# Altium schematic sheet digital_ruler _new.SchDoc: Digital Ruler
size A4; DrawnBy: Malith Jayalath; Revision: 3; SheetNumber: 1; SheetTotal: 1
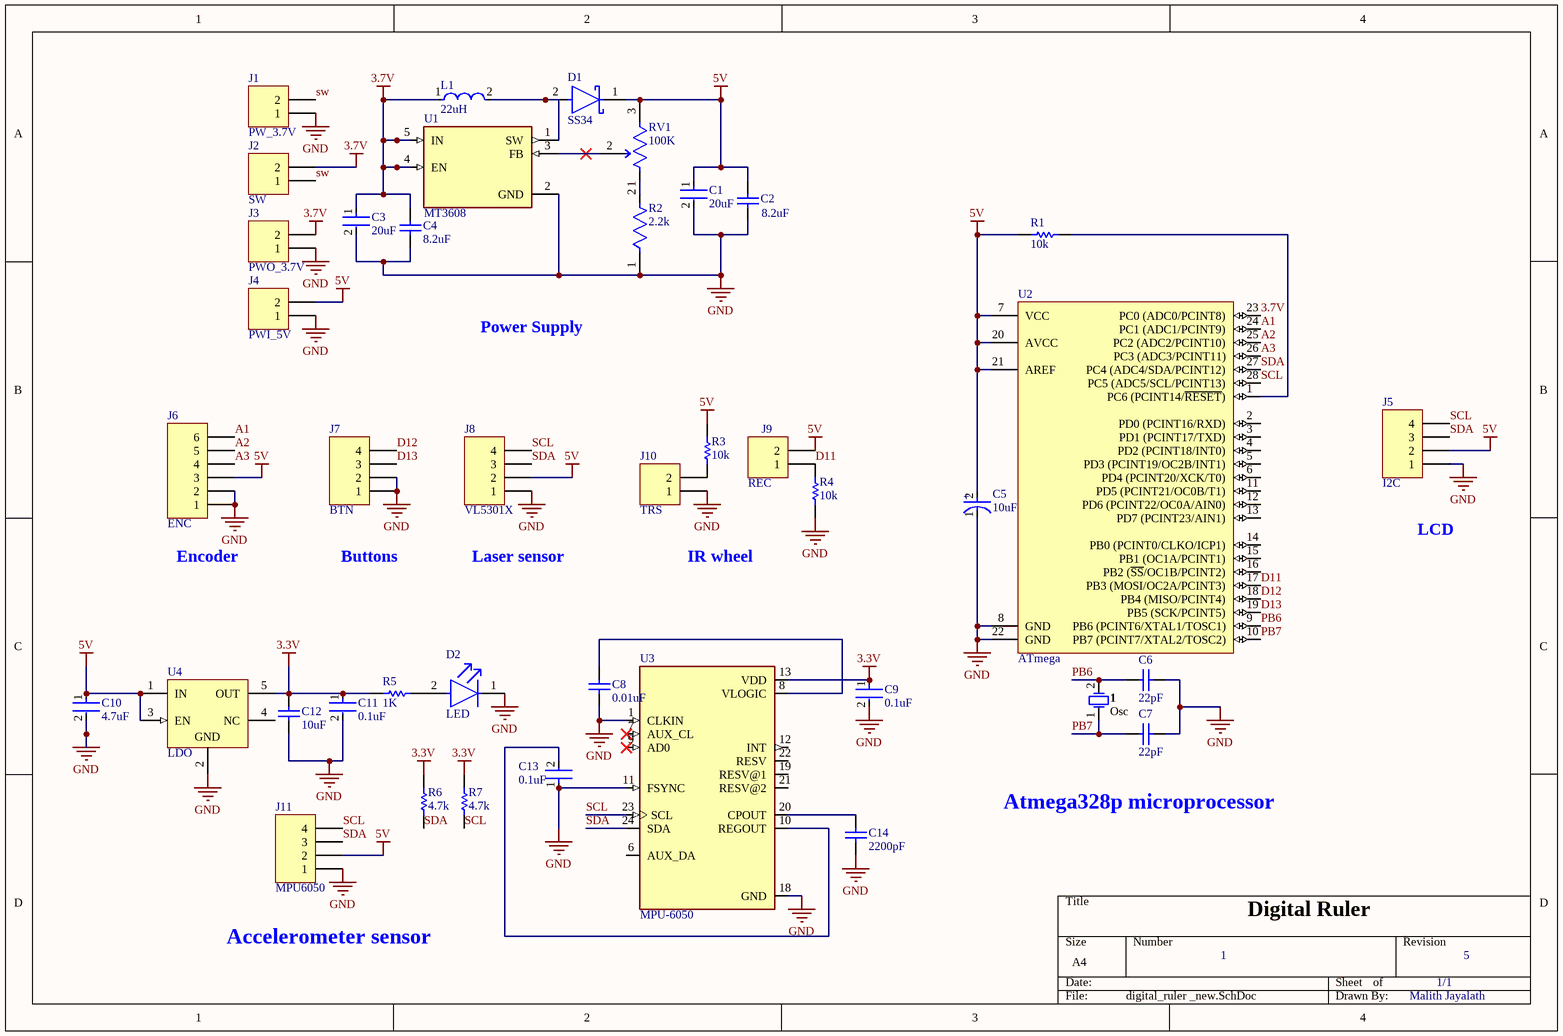
[diagram p0: digital_ruler _new.SchDoc]

## Parts
1  Osc  [FOX-FOXSLF160-20]
C1  20uF  [FP-GRMJN7-0_1-IPC_C]
C2  8.2uF  [CAPC1206(3216)190_N]
C3  20uF  [FP-GRMJN7-0_1-IPC_C]
C4  8.2uF  [CAPC1206(3216)190_N]
C5  10uF  [FP-FKC-MFG]
C6  22pF  [CAPC1608X90X35ML10T15]
C7  22pF  [CAPC1608X90X35ML10T15]
C8  0.01uF  [CAPC1608X90X35ML10T15]
C9  0.1uF  [FP-CGA6P-IPC_A]
C10  4.7uF  [FP-CL10-IPC_A]
C11  0.1uF  [FP-CGA6P-IPC_A]
C12  10uF  [CAPC2013X95X50LL10T25]
C13  0.1uF  [FP-CGA6P-IPC_A]
C14  2200pF  [CAPC1608X90X35NL10T15]
D1  SS34  [FP-95402-MFG]
D2  LED  [FP-LTST-C193TBKT-5A-MFG]
J1  PW_3.7V  [HDR1X2]
J2  SW  [HDR1X2]
J3  PWO_3.7V  [HDR1X2]
J4  PWI_5V  [HDR1X2]
J5  I2C  [HDR1X4]
J6  ENC  [HDR1X6]
J7  BTN  [HDR1X4]
J8  VL5301X  [HDR1X4]
J9  REC  [HDR1X2]
J10  TRS  [HDR1X2]
J11  MPU6050  [HDR1X4]
L1  22uH  [FP-IHLP-2525CZ-FP_2_413x3-MFG]
R1  10k  [RESC1005X40X25ML05T05]
R2  2.2k  [FP-ERA2A-MFG]
R3  10k  [RESC1005X40X25ML05T05]
R4  10k  [RESC1005X40X25ML05T05]
R5  1K  [RESC2013X60X35ML10T20]
R6  4.7k  [RESC2013X70X40NL20T20]
R7  4.7k  [RESC2013X70X40NL20T20]
RV1  100K  [FP-3386P-MFG]
U1  MT3608  [SOT95P280X145-6N]
U2  ATmega  [28P3]
U3  MPU-6050  [QFN50P400X400X95-24N]
U4  LDO  [DBV0005A_M]

## Nets
3.3V: C9.1 C11.1 C12.2 R5.1 R6.1 R7.1 U3.13(VDD) U4.5(OUT)
3.7V: C3.1 C4.2 J2.2 J3.2 L1.1 U1.4(EN) U1.5(IN) U2.23(PC0_(ADC0/PCINT8))
5V: C1.1 C2.2 C5.2(A) C10.1 D1.1(C) J4.2 J5.2 J6.3 J8.2 J9.2 J11.2 R1.1 R3.1 RV1.3(CW) U2.7(VCC) U2.20(AVCC) U2.21(AREF) U4.1(IN) U4.3(EN)
GND: C1.2 C2.1 C3.2 C4.1 C5.1(C) C6.1 C7.1 C8.1 C9.2 C10.2 C11.2 C12.1 C13.1 C14.1 D2.1(C) J1.1 J3.1 J4.1 J5.1 J6.1 J6.2 J7.1 J7.2 J8.1 J10.1 J11.1 R2.1 R4.1 U1.2(GND) U2.8(GND) U2.22(GND) U3.1(CLKIN) U3.11(FSYNC) U3.18(GND) U4.2(GND)
A1: J6.6 U2.24(PC1_(ADC1/PCINT9))
A2: J6.5 U2.25(PC2_(ADC2/PCINT10))
A3: J6.4 U2.26(PC3_(ADC3/PCINT11))
D11: J9.1 R4.2 U2.17(PB3_(MOSI/OC2A/PCINT3))
D12: J7.4 U2.18(PB4_(MISO/PCINT4))
D13: J7.3 U2.19(PB5_(SCK/PCINT5))
PB6: 1.2 C6.2 U2.9(PB6_(PCINT6/XTAL1/TOSC1))
PB7: 1.1 C7.2 U2.10(PB7_(PCINT7/XTAL2/TOSC2))
SCL: J5.4 J8.4 J11.4 R7.2 U2.28(PC5_(ADC5/SCL/PCINT13)) U3.23(SCL)
SDA: J5.3 J8.3 J11.3 R6.2 U2.27(PC4_(ADC4/SDA/PCINT12)) U3.24(SDA)
sw: J1.2 J2.1
NetC8_2: C8.2 U3.8(VLOGIC)
NetC13_2: C13.2 U3.10(REGOUT)
NetC14_2: C14.2 U3.20(CPOUT)
NetD1_2: D1.2(A) L1.2 U1.1(SW)
NetD2_2: D2.2(A) R5.2
NetJ10_2: J10.2 R3.2
NetR1_2: R1.2 U2.1(PC6_(PCINT14/~{RESET}))
NetR2_2: R2.2 RV1.1(CCW)
NetRV1_2: RV1.2(WIPER) U1.3(FB)

Not connected (* = marked no-connect by the designer): U2 2(PD0_(PCINT16/RXD)) 3(PD1_(PCINT17/TXD)) 4(PD2_(PCINT18/INT0)) 5(PD3_(PCINT19/OC2B/INT1)) 6(PD4_(PCINT20/XCK/T0)) 11(PD5_(PCINT21/OC0B/T1)) 12(PD6_(PCINT22/OC0A/AIN0)) 13(PD7_(PCINT23/AIN1)) 14(PB0_(PCINT0/CLKO/ICP1)) 15(PB1_(OC1A/PCINT1)) 16(PB2_(~{SS}/OC1B/PCINT2)); U3 6(AUX_DA) 7(AUX_CL)* 9(AD0)* 12(INT) 19(RESV@1) 21(RESV@2) 22(RESV); U4 4(NC)

## Notes on the sheet
- Power Supply
- LCD
- (near J6) Encoder
- Buttons
- Laser sensor
- IR wheel
- Atmega328p microprocessor
- Accelerometer sensor
- Digital Ruler
- 1
- 1/1
- 5
- Malith Jayalath
- (in symbol CMP-05427-000030-1) +

## Library data of the parts
1 = CMP-1749-00003-1: Resistance Weld Thru-Hole Crystal, 16 MHz, -20 to 70 degC, 2-Pin THD, RoHS, Bulk; Voltage Rating: 250 V; Tolerance: 1%; Resistance: 221 kohm; Case\Package: Axial; Power Rating: 250 mW; RoHSCompliant: true; Package Quantity: 200; Packaging: Bulk; Min Operating Temperature: -55 degC; DatasheetVersion: Mar-15; ComponentLink1URL: http://www.foxonline.com/; Max Operating Temperature: 155 degC; PackageReference: FOXSLF160-20; Mount: Through Hole; PackageDescription: 2-Pin Through Hole Device, Body 11.35 x 4.65 mm; ComponentLink1Description: Manufacturer URL; ComponentLink2URL: http://www.foxonline.com/pdfs/hc49slf.pdf; ComponentLink2Description: Datasheet; Length: 0.248 inch
C1 C3 = CMP-06035-061017-1: Chip Multilayer Ceramic Capacitors for General Purpose, 0704, 20uF, X5R, 15%, 20%, 16V
C2 C4 = CMP-1037-04959-1: CAP 8.2uF 16V ±20% 1206 (3216 Metric) Thickness 1.9mm SMD; Case-EIA: 1206; Case-Metric: 3216; Tolerance: Â±20%; Technology: SMT; Max Thickness: 1.9 mm; Value: 8.2uF; Rated Voltage: 16 V
C5 = CMP-05427-000030-1: CAP ALUM 10UF 20% 50V SMD; Impedance: 1.52R; Ripple Current (AC): 85mA; Life (Hours): 2000Hour; Leakage Current: 3uA; Dielectric Material: Aluminium; Length: 5.8mm; Voltage Rating: 50V; Radiation Hardening: No; Max Operating Temperature: 105°C; REACH SVHC: No SVHC; Tolerance: 20%; RoHS Compliant: Yes; Case/Package: Radial; Height: 5.8mm; Voltage: 50V; Diameter: 5mm; Number of Pins: 2; Ripple Current: 85mA; Series: FK; Lead Free: Lead Free; Width: 6.5mm; ESR (Equivalent Series Resistance): 1.52R; Package Quantity: 1000; Construction: Cylindrical; Voltage Rating (DC): 50V; Packaging: Tape and Reel; Height - Seated (Max): 0.228inch; Contact Plating: Tin; Capacitance: 10uF; Min Operating Temperature: -55°C; Termination: SMD/SMT; Material: Aluminium; Mount: Surface Mount
C6 C7 = CMP-2000-04945-1: Chip Capacitor, 22 pF, +/- 5%, 50 V, -55 to 125 degC, 0603 (1608 Metric), RoHS, Tape and Reel; Manufacturer: Murata; Rated Voltage: 50V; Dielectric: C0G; Capacitance: 22pF; Manufacturer URL: http://www.murata.com/; Datasheet Version: Jul-06; Package Reference: 603; Tolerance (%): ±5%; Case Size/Dimension: 0603; Package Description: 2-Pin Surface Mount Device, Body 1.6 x 0.8 mm; Datasheet URL: https://datasheet.ciiva.com/11786/0900766b807a1cab-11786398.pdf
C8 = CMP-2100-03642-1: Chip Capacitor, 10 nF, +/- 10%, 50 V, -55 to 125 degC, 0603 (1608 Metric), RoHS, Tape and Reel; Manufacturer: Murata; Insulation Resistance: 10GR; Dielectric: X7R; Voltage Rating: 50V; Capacitance: 10nF; Material: Ceramic; Package Quantity: 1; Lead Free: LeadFree; Case/Package: 0603; Termination: SMD/SMT; REACH SVHC: Unknown; Manufacturer URL: http://www.murata.com/; Datasheet URL: http://search.murata.co.jp/Ceramy/image/img/A01X/G101/ENG/GRM188R71H103KA01-01.pdf; Mount: SurfaceMount; Datasheet Version: 42401.0; Number of Pins: 2; Length: 1.6mm; Voltage: 50V; Depth: 0.8mm; Tolerance: 10%; Min Operating Temperature: -55degC; Voltage Rating (DC): 50V; Max Operating Temperature: 125degC; Package Description: 2-Pin Surface Mount Device, Body 1.6 x 0.8 mm; RoHSCompliant: True; Case Code (Imperial): 0603; Width: 0.031inch; Case Code (Metric): 1608; Height: 0.8mm; Package Reference: 0603; Packaging: TapeandReel; Thickness: 0.035inch; Dielectric Material: Ceramic
C9 C11 C13 = CMP-08246-002289-1: Cap Ceramic 100nF 250V X7R 10% Pad SMD 1210 +125°C Automotive T/R; Case Code (Metric): 3225; Tolerance: 10%; Max Operating Temperature: 125°C; Termination: SMD/SMT; Ratings: AEC-Q200; Voltage Rating: 250V; Case/Package: 1210; Features: Soft Termination; Depth: 2.5mm; Width: 0.098inch; Length: 3.2mm; Weight: 0.000564oz; Packaging: Tape and Reel; Thickness: 0.087inch; Min Operating Temperature: -55°C; Case Code (Imperial): 1210; Voltage Rating (DC): 250V; Height: 2mm; Capacitance: 100nF; Dielectric: X7R; Mount: Surface Mount; Package Quantity: 1
C10 = CMP-13271-001817-1: Cap Ceramic 4.7uF 6.3V X6S ±10% Pad SMD 0603 +105°C T/R; Length: 1.6mm; Tolerance: 10%; Packaging: Tape and Reel; Dielectric: X6S; Lead Free: Lead Free; Package Quantity: 1; Case/Package: 0603; Max Operating Temperature: 105°C; Radiation Hardening: No; Thickness: 0.035inch; Depth: 0.8mm; Capacitance: 4.7uF; Case Code (Metric): 1608; Voltage Rating (DC): 6.3V; Height: 0.8mm; Voltage Rating: 6.3V; Mount: Surface Mount; Min Operating Temperature: -55°C; Case Code (Imperial): 0603; Width: 0.031inch
C12 = CMP-2000-06497-1: Chip Capacitor, 10 uF, +/- 10%, 6.3 V, -55 to 85 degC, 0805 (2012 Metric), RoHS, Tape and Reel; Manufacturer: Taiyo Yuden; PCN Part Number: X5R,X7RDielectrics23/Jan/2008; Other Names: 587-1304-6; Capacitance: 10µF; Temperature Coefficient: X5R; Catalog Drawings: xMKSeries_0805_0.85; Voltage - Rated: 6.3V; Online Catalog: MSeries; Package Reference: 0805; Family: CeramicCapacitors; Packaging: Digi-Reel®; Thickness (Max): 0.037"(0.95mm); Ratings: -; Package / Case: 0805(2012Metric); Datasheet URL: http://www.yuden.co.jp/productdata/catalog/en/mlcc_all_e.pdf; Mounting Type: SurfaceMount,MLCC; Manufacturer URL: http://www.t-yuden.com/; Category: Capacitors; Applications: GeneralPurpose; Size / Dimension: 0.079"Lx0.049"W(2.00mmx1.25mm); Height - Seated (Max): -; Features: -; Lead Style: -; Lead Spacing: -; Standard Package: 1; Mounting Technology: SurfaceMount; Series: M; Operating Temperature: -55°C~85°C; Tolerance: ±10%; Datasheet Version: 09/2015; Package Description: 2-Pin Surface Mount Device, Body 2 x 1.25 mm
C14 = CMP-2006-02908-5: Chip Capacitor, 2.2 nF, +/- 10%, 50 V, -55 to 125 degC, 0603 (1608 Metric), RoHS, Tape and Reel; Manufacturer: Murata; Voltage Rating: 50 V; Pins: 2; Mount: Surface Mount; Max Operating Temperature: 125 degC; ComponentLink1Description: Manufacturer URL; RoHSCompliant: true; PackageDescription: 2-Pin Surface Mount Device, Body 1.6 x 0.8 mm; ComponentLink2URL: http://search.murata.co.jp/Ceramy/image/img/A01X/G101/ENG/GRM188R71H222KA01-01.pdf; PackageReference: 0603; Height: 0.8 mm; Lead Pitch: 4 mm; Packaging: Tape and Reel; DatasheetVersion: 02/2016; Mounting Technology: Surface Mount; ComponentLink2Description: Datasheet; Min Operating Temperature: -55 degC; Length: 1.6 mm; REACH SVHC: No SVHC; Package Quantity: 4000; ComponentLink1URL: http://www.murata.com/
D1 = CMP-02539-000012-1: DIODE SCHOTTKY 40V 3A DO214AB; Manufacturer: Vishay; Manufacturer Part Number: SS34-E3/57T; Max Junction Temp: +150°C; Peak Reverse Current: 0.5mA; Max Surge Forward Current: 100A; Standoff Height: 0mm; ComponentLink2Description: Datasheet; Device Class L3: Schottky Diodes; Height: 2.62mm; Max Repetitive Reverse Voltage: 40V; Lead Free: Yes; Package: 95402; Temperature Range High: +150°C; ComponentLink2URL: http://www.vishay.com/docs/88751/ss32.pdf; Temperature: -55°C to +150°C; Footprint Url: http://www.vishay.com/docs/95402/smc.pdf; Automotive: No; Forward Current: 3A; Category: Diode; RoHS: TRUE; Device Class L2: Diodes; Mouser Description: Schottky Diodes & Rectifiers 3.0 Amp 40 Volt; Octopart: https://octopart.com/ss34-e3%2F57t-vishay-39552907; Temperature Range Low: -55°C; Device Class L1: Discrete Semiconductors; Digikey Description: DIODE SCHOTTKY 40V 3A DO214AB
D2 = CMP-2000-06624-2: LED BLUE CLEAR CHIP SMD; Number of Elements: 1; Forward Voltage: 2.8V; Forward Current: 20mA; Test Current: 5mA; Lens Color: Colorless; Dominant Wavelength: 475nm; Reverse Voltage: 5V; Viewing Angle: 130°; Lens Style: Diffused; Luminous Intensity: 15mcd; Power Dissipation: 76mW; Max Operating Temperature: 80°C; Length: 1.6mm; Number of LEDs: 1; Case/Package: 0603; Case Code (Metric): 1608; Number of Pins: 2; Radiation Hardening: No; Min Operating Temperature: -20°C; Width: 0.8mm; Packaging: Tape and Reel; Package Quantity: 1; Lead Free: Lead Free; Lens Transparency: Clear; Illumination Color: Blue; Color: Blue; RoHS Compliant: Yes; Mount: Surface Mount; Depth: 0.8mm; Case Code (Imperial): 0603; Height: 0.35mm
J1-J4 J9 J10 = Header 2: Header, 2-Pin; LatestRevisionDate: 17-Jul-2002; LatestRevisionNote: Re-released for DXP Platform.; Publisher: Altium Limited
J5 J7 J8 J11 = Header 4: Header, 4-Pin; LatestRevisionDate: 17-Jul-2002; LatestRevisionNote: Re-released for DXP Platform.; Publisher: Altium Limited
J6 = Header 6: Header, 6-Pin; LatestRevisionDate: 17-Jul-2002; LatestRevisionNote: Re-released for DXP Platform.; Publisher: Altium Limited
L1 = CMP-2000-06442-2: Commercial Inductors, Low DCR Series 22uH 2.9A 135mΩ 20%; Self Resonant Frequency: 1MHz; Shielding: Shielded; Core Material: Ferrite; DC Resistance (DCR): 135mR; Test Frequency: 100kHz; Saturation Current: 2.5A; Case/Package: 2525; Inductance Tolerance: 20%; Max DC Current: 2.9A; Inductance: 22uH; Termination: SMD/SMT; Case Code (Imperial): 2525; Mount: Surface Mount; Military Standard: Not; Min Operating Temperature: -55°C; RMS Current (Irms): 2.9A; Package Quantity: 2000; Max Operating Temperature: 125°C; Length: 7.24mm; Depth: 6.72mm; Packaging: Tape and Reel; Height: 3mm; Width: 0.255inch; Lead Free: Lead Free; Tolerance: 20%; Contact Plating: Tin; Current Rating: 2.9A; Number of Pins: 2; Case Code (Metric): 6363; Radiation Hardening: No; Height - Seated (Max): 0.118inch
R1 R3 R4 = CMP-2002-00433-1: Part Number: ERJ-2GEJ103X; Manufacturer: Panasonic
R2 = CMP-2002-05881-2: RES SMD 2.2K OHM 0.1% 1/16W 0402; Manufacturer Part Number: ERA-2AEB222X; Manufacturer: Panasonic; Temperature Coefficient: 25ppm/°C; Power Rating: 0.063W; Value: 2.2kΩ; Voltage Rating: 50V; Automotive Grade: Grade 0; Automotive: Yes; Device Class L1: Passive Components; Tolerance: 0.1%; Digikey Description: RES SMD 2.2K OHM 0.1% 1/16W 0402; Device Class L2: Resistors; Octopart: https://octopart.com/era-2aeb222x-panasonic-9251391; ComponentLink2Description: Datasheet; Ipc Land Pattern Name: RESC10050X35; Package: ERA2A; Height: 0.4mm; ComponentLink2URL: https://industrial.panasonic.com/cdbs/www-data/pdf/RDM0000/AOA0000C307.pdf; Temperature Range High: +155°C; Device Class L3: Chip SMD Resistors; Temperature Range Low: -55°C; Lead Free: Yes; Mouser Description: Thin Film Resistors - SMD 0402 1/16W 2.2Kohms; Footprint Url: https://b2b-api.panasonic.eu/file_stream/pids/fileversion/1079; Temperature: -55°C to +155°C; Category: Res; Resistance: 2.2kΩ; Composition: Metal Film; Series: E24; RoHS: TRUE
R5 = CMP-2100-03671-1: Chip Resistor, 1 KOhm, +/- 1%, 125 mW, -55 to 155 degC, 0805 (2012 Metric), RoHS, Tape and Reel; Manufacturer: Yageo; Temperature Coefficient: 100ppm/degreesC; Voltage Rating (DC): 150V; Max Power Dissipation: 125mW; Resistance: 1KOhm; Number of Pins: 2; Number of Terminations: 2; Datasheet URL: http://www.yageo.com/NewPortal/yageodocoutput?fileName=/pdf/R-Chip/PYu-RC_Group_51_RoHS_L_5.pdf; Length: 0.079inch; Package Description: 2-Pin Surface Mounted Device, Body 2 x 1.25 mm; Depth: 1.25mm; Height: 0.024inch; Military Standard: Not; Case/Package: 0805; Package Reference: 0805; RoHSCompliant: true; Lead Free: LeadFree; Packaging: TapeandReel; Package Quantity: 1; Datasheet Version: Rev. 5, 10/2016; Tolerance: 1%; Min Operating Temperature: -55degC; Voltage Rating: 150V; Composition: ThickFilm; Case Code (Imperial): 0805; Power Rating: 125mW; Width: 0.049inch; Case Code (Metric): 2012; Manufacturer URL: http://www.yageo.com/; Max Operating Temperature: 155degC; REACH SVHC: Unknown; Termination: SMD/SMT
R6 R7 = CMP-2001-00550-5: Chip Resistor, 4.7 KOhm, +/- 1%, 0.125 W, -55 to 155 degC, 0805 (2012 Metric), RoHS, Tape and Reel; Manufacturer: Panasonic; Voltage Rating: 150 V; Min Operating Temperature: -55 degC; PackageReference: 0805; Mounting Technology: Surface Mount; Height: 0.6 mm; PackageDescription: 2-Pin Surface Mount Device, Body 2 x 1.25 mm; RoHSCompliant: true; Length: 2 mm; REACH SVHC: Yes; Packaging: Tape and Reel; Pins: 2; Mount: Surface Mount; ComponentLink2Description: Datasheet; ComponentLink1URL: http://www.panasonic.com/; ComponentLink1Description: Manufacturer URL; DatasheetVersion: 04/2015; Package Quantity: 5000; ComponentLink2URL: http://industrial.panasonic.com/cdbs/www-data/pdf/RDA0000/AOA0000C86.pdf; Max Operating Temperature: 155 degC
RV1 = CMP-2000-05592-8: TRIMMER 100K OHM 0.5W PC PIN TOP; Manufacturer Series: 3386; Resistance Law: Linear; Voltage Rating: 300V; Actuator Orientation: Vertical; Tolerance: 10%; Number of Turns: 1; Resistance: 100kR; Number of Terminals/Pins: 3; Temperature Coefficient: 100ppm/°C; Max Power Dissipation: 500mW; Actuator Type: SCREW; Radiation Hardening: No; Package Quantity: 100; Type: Potentiometer; Contact Plating: Tin; RoHS Compliant: Yes; Depth: 9.53mm; Terminal Finish: Tin; Taper: Linear; Color: Blue; Number of Pins: 3; Width: 9.53mm; Lead Free: Contains Lead; Reach SVHC Compliant: Yes; Packaging: Rail/Tube; Min Operating Temperature: -55°C; Max Operating Temperature: 125°C; Technology: CERMET; Height: 4.83mm; Series: Trimpot® 3386 - Sealed; Termination: Pin; Resistance Tolerance: 10%; Power Rating: 500mW; Resistor Type: Cermet; Mount: Through Hole; Military Standard: Not; Length: 9.53mm; Weight: 0.03oz
U1 = MT3608: High Efficiency 1.2MHz 2A Step Up Converter; MF: {'manufacturer': u'Aerosemi Technology Co., Ltd'}; Price: None; Package: None; Availability: Unavailable; Value: *; MP: MT3608
U2 = CMP-0095-00013-2: 8-bit AVR Microcontroller, 32KB Flash, 1KB EEPROM, 2KB SRAM, 28-pin PDIP, Industrial Grade (-40°C to 85°C); RevisionNote: DatasheetVersion updated. URLs added.; PackageVersion: revB, Sep-2001; PackageDescription: 28-lead (0.300"/7.62mm Wide) Plastic Dual Inline Package (PDIP); DatasheetVersion: revD, May-2011; ComponentLink1Description: Manufacturer URL; ComponentLink1URL: http://www.atmel.com/; PackageReference: 28P3; ComponentLink2Description: ATmega48A/48PA/88A/88PA/168A/168PA/328/328P Datasheet; ComponentLink3URL: http://www.atmel.com/dyn/resources/prod_documents/8271S.pdf; ComponentLink2URL: http://www.atmel.com/dyn/resources/prod_documents/8271.pdf; ComponentLink3Description: ATmega48A/48PA/88A/88PA/168A/168PA/328/328P Summary
U3 = MPU-6050: MPU-6050 Six-Axis (Gyro + Accelerometer) MEMS MotionTrackingâ„¢ Devices; MF: {'manufacturer': u'TDK InvenSense'}; Value: *; Price: None; Package: None; Availability: Unavailable; MP: MPU-6050
U4 = CMP-0394-00692-2: Single Output LDO, 100 mA, Fixed 3.3 V Output, 3.68 to 16 V Input, with Low IQ, 5-pin SOT-23 (DBV), -40 to 125 degC, Green (RoHS & no Sb/Br); PartNumber: TPS76133DBVT; Manufacturer: Texas Instruments; Accuracy(%): 2; Iout(Max)(A): 0.1; Vin(Min)(V): 3.68; Vdo(Typ)(mV): 170; Iq(Typ)(mA): 2.6; Vout Adj(Min)(V): 3.3; SubFamily: Single Channel LDO; Vin(Max)(V): 16; DatasheetVersion: SLVS178B; ComponentLink2Description: Datasheet; PackageVersion: 4073253-4/K; Eco-Plan: Green (RoHS & no Sb/Br); Code_JEDEC: MO-178; ComponentLink3Description: Package Specification; Mounting Technology: Surface Mount; ComponentLink1URL: http://www.ti.com/; PackageDescription: 5-Pin Plastic Small Outline, Body 1.60 Ãƒâ€” 2.90 mm, Pitch 0.95 mm; PackageReference: DBV0005A; Vout Adj(Max)(V): 3.3; Fixed Output Options(V): 3.3; ComponentLink2URL: http://www.ti.com/general/docs/lit/getliterature.tsp?genericPartNumber=TPS76133&fileType=pdf; ComponentLink3URL: http://www.ti.com/litv/pdf/mpds018i; ComponentLink1Description: Manufacturer URL